# EAGLE schematic relay_switch_fet (EAGLE 9.1.3)
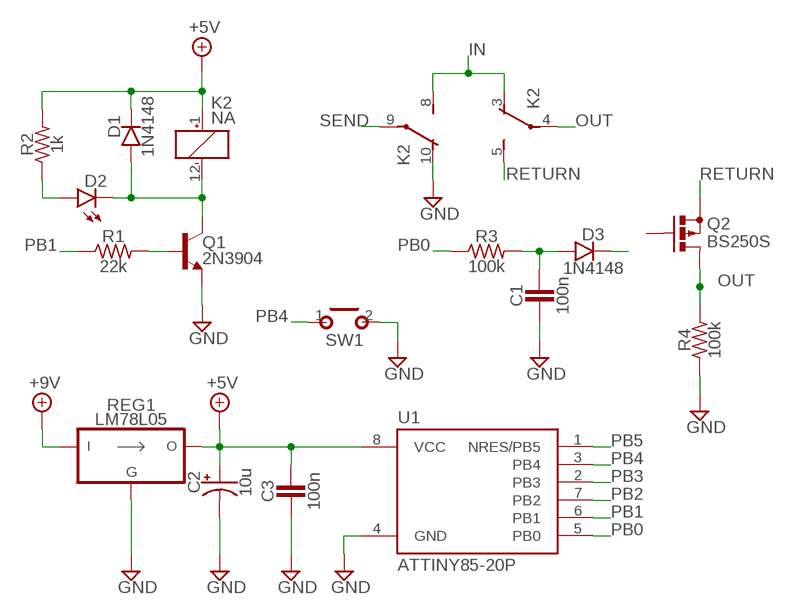
[diagram p0: schematic, sheet 1]

## Parts
C1  100n  CER/FILMBOX.1  [BOX_SMALL]
C2  10u  0500  [050_020]
C3  100n  CER/FILM2  [050X030_025_2]
D1  1N4148  DO35.2  [DO35-2]
D2  LED  [3MM_D]
D3  1N4148  DO35.2  [DO35-2]
K2  NA  [NA]
Q1  2N3904  [TO92-]
Q2  BS250S  [SOT54ES]
R1  22k  R_.3B  [R0207/3]
R2  1k  R_.3B  [R0207/3]
R3  100k  R_.3B  [R0207/3]
R4  100k  R_.3B  [R0207/3]
REG1  LM78L05  [TO92-]
SW1  MOMENTARY  [SPST]
U1  ATTINY85-20P  [PDIP08_300MIL]

## Nets
+5V: C2.+ C3.1 D1.C K2.1(1:+) R2.2 REG1.3(VO) U1.8(VCC)
+9V: REG1.1(VI)
GND: C1.2 C2.- C3.2 K2.10(3:O) Q1.3(E) R4.1 REG1.2(GND) SW1.2(S) U1.4(GND)
IN: K2.3(2:O) K2.8(3:S)
N$2: D1.A D2.P$1(C) K2.12(1:-) Q1.1(C)
N$3: Q1.2(B) R1.2
N$4: D2.ANODE(A) R2.1
N$5: D3.C
N$6: C1.1 D3.A R3.2
OUT: K2.4(2:P) Q2.D R4.2
PB0: R3.1 U1.5(PB0)
PB1: R1.1 U1.6(PB1)
PB2: U1.7(PB2)
PB3: U1.2(PB3)
PB4: SW1.1(P) U1.3(PB4)
PB5: U1.1(NRES/PB5)
RETURN: K2.5(2:S) Q2.S
SEND: K2.9(3:P)
Unconnected: Q2.G

## Library data of the parts
C1 C3 = pedals-capacitors-film:CER/FILM: 47 - 120pF Xicon Ceramic Disc 2.5mm lead spacing
C2 = pedals-capacitors-elec:050
D1 D3 = pedals-diodes:DO35: DO-35 Package Diodes: 1N914
D2 = pedals-diodes:LED
K2 = pedals-relays:NA: RELAY; OC_FARNELL: unknown; OC_NEWARK: unknown
Q1 = pedals-transistors:2N3904: NPN Transistor
Q2 = pedals-transistors:BS250: P-CHANNEL MOS FET
R1-R4 = pedals-resistors:R_
REG1 = pedals-regulators:LM78L05
SW1 = pedals-switches:MOMENTARY
U1 = pedals-microcontrollers:ATTINY85*: ATMEL ATtiny 85 Packages: P = PDIP 08 30mil S = SOIC 08 EIAJ 208mil Technologies Note: for complete ordering code (temp. range, finish, tape&reel etc.) see www.atmel.com • Supply Voltage: V = (1.8…5.5)V | [blank] = (2.7…5.5)V • Speed: 10 = 10 MHz | 20 = 20 MHz Author: Dipl.-Ing. FH Rainer Bayer HHN Hochschule Heilbronn (Heilbronn University), rainer.bayer@hs-heilbronn.de Ingenieurbüro ing-rb, mail@ing-rb.de